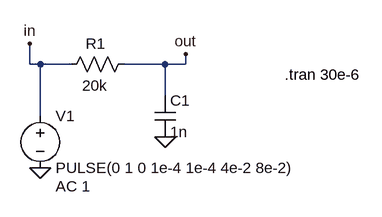
[diagram p0: schematic LED.asc]
LED.asc, the LTspice schematic file:
Version 4
SHEET 1 880 680
WIRE 16 96 16 64
WIRE 32 96 16 96
WIRE 80 96 32 96
WIRE 224 96 160 96
WIRE 256 96 256 80
WIRE 256 96 224 96
WIRE 224 144 224 96
WIRE 32 176 32 96
FLAG 32 256 0
FLAG 224 208 0
FLAG 256 80 out
FLAG 16 64 in
SYMBOL voltage 32 160 R0
WINDOW 123 24 124 Left 2
WINDOW 39 0 0 Left 0
SYMATTR InstName V1
SYMATTR Value PULSE(0 1 0 1e-4 1e-4 4e-2 8e-2)
SYMATTR Value2 AC 1
SYMBOL res 176 80 R90
WINDOW 0 0 59 VBottom 2
WINDOW 3 33 60 VTop 2
SYMATTR InstName R1
SYMATTR Value 20k
SYMBOL cap 208 144 R0
SYMATTR InstName C1
SYMATTR Value 1n
TEXT 408 112 Left 2 !.tran 30e-6

The netlist it stands for:
* LED.asc
V1 in 0 PULSE(0 1 0 1e-4 1e-4 4e-2 8e-2) AC 1
R1 out in 20k
C1 out 0 1n
.tran 30e-6
.backanno
.end